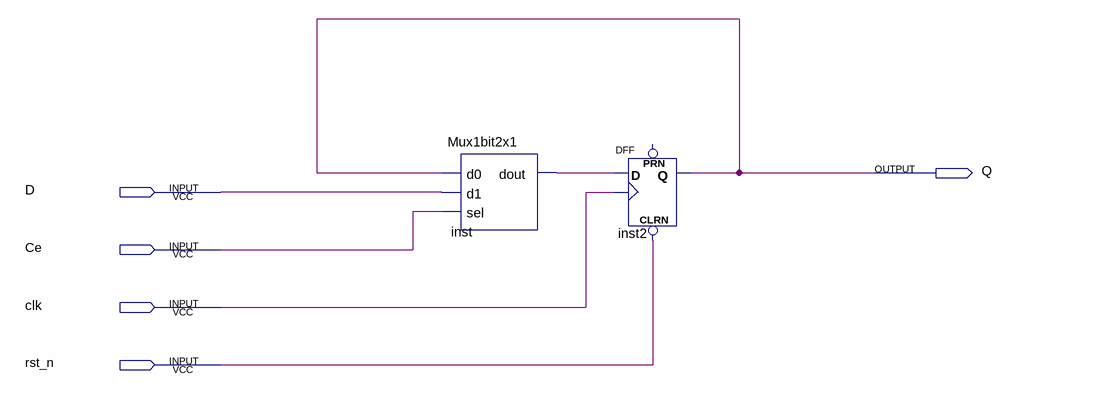
[diagram p0: schematic sheet]
// Quartus schematic Register1.bdf as structural Verilog: 2 symbols, 5 pins
module Register1 (
  input  D,
  input  Ce,
  input  clk,
  input  rst_n,
  output Q
);

  wire inst_dout;

  Mux1bit2x1 inst (.d0(Q), .d1(D), .sel(Ce), .dout(inst_dout));
  DFF inst2 (.CLRN(rst_n), .CLK(clk), .D(inst_dout), .Q(Q));  // open: PRN
endmodule
